# EAGLE design coin_acceptor (EAGLE 8.3.1)
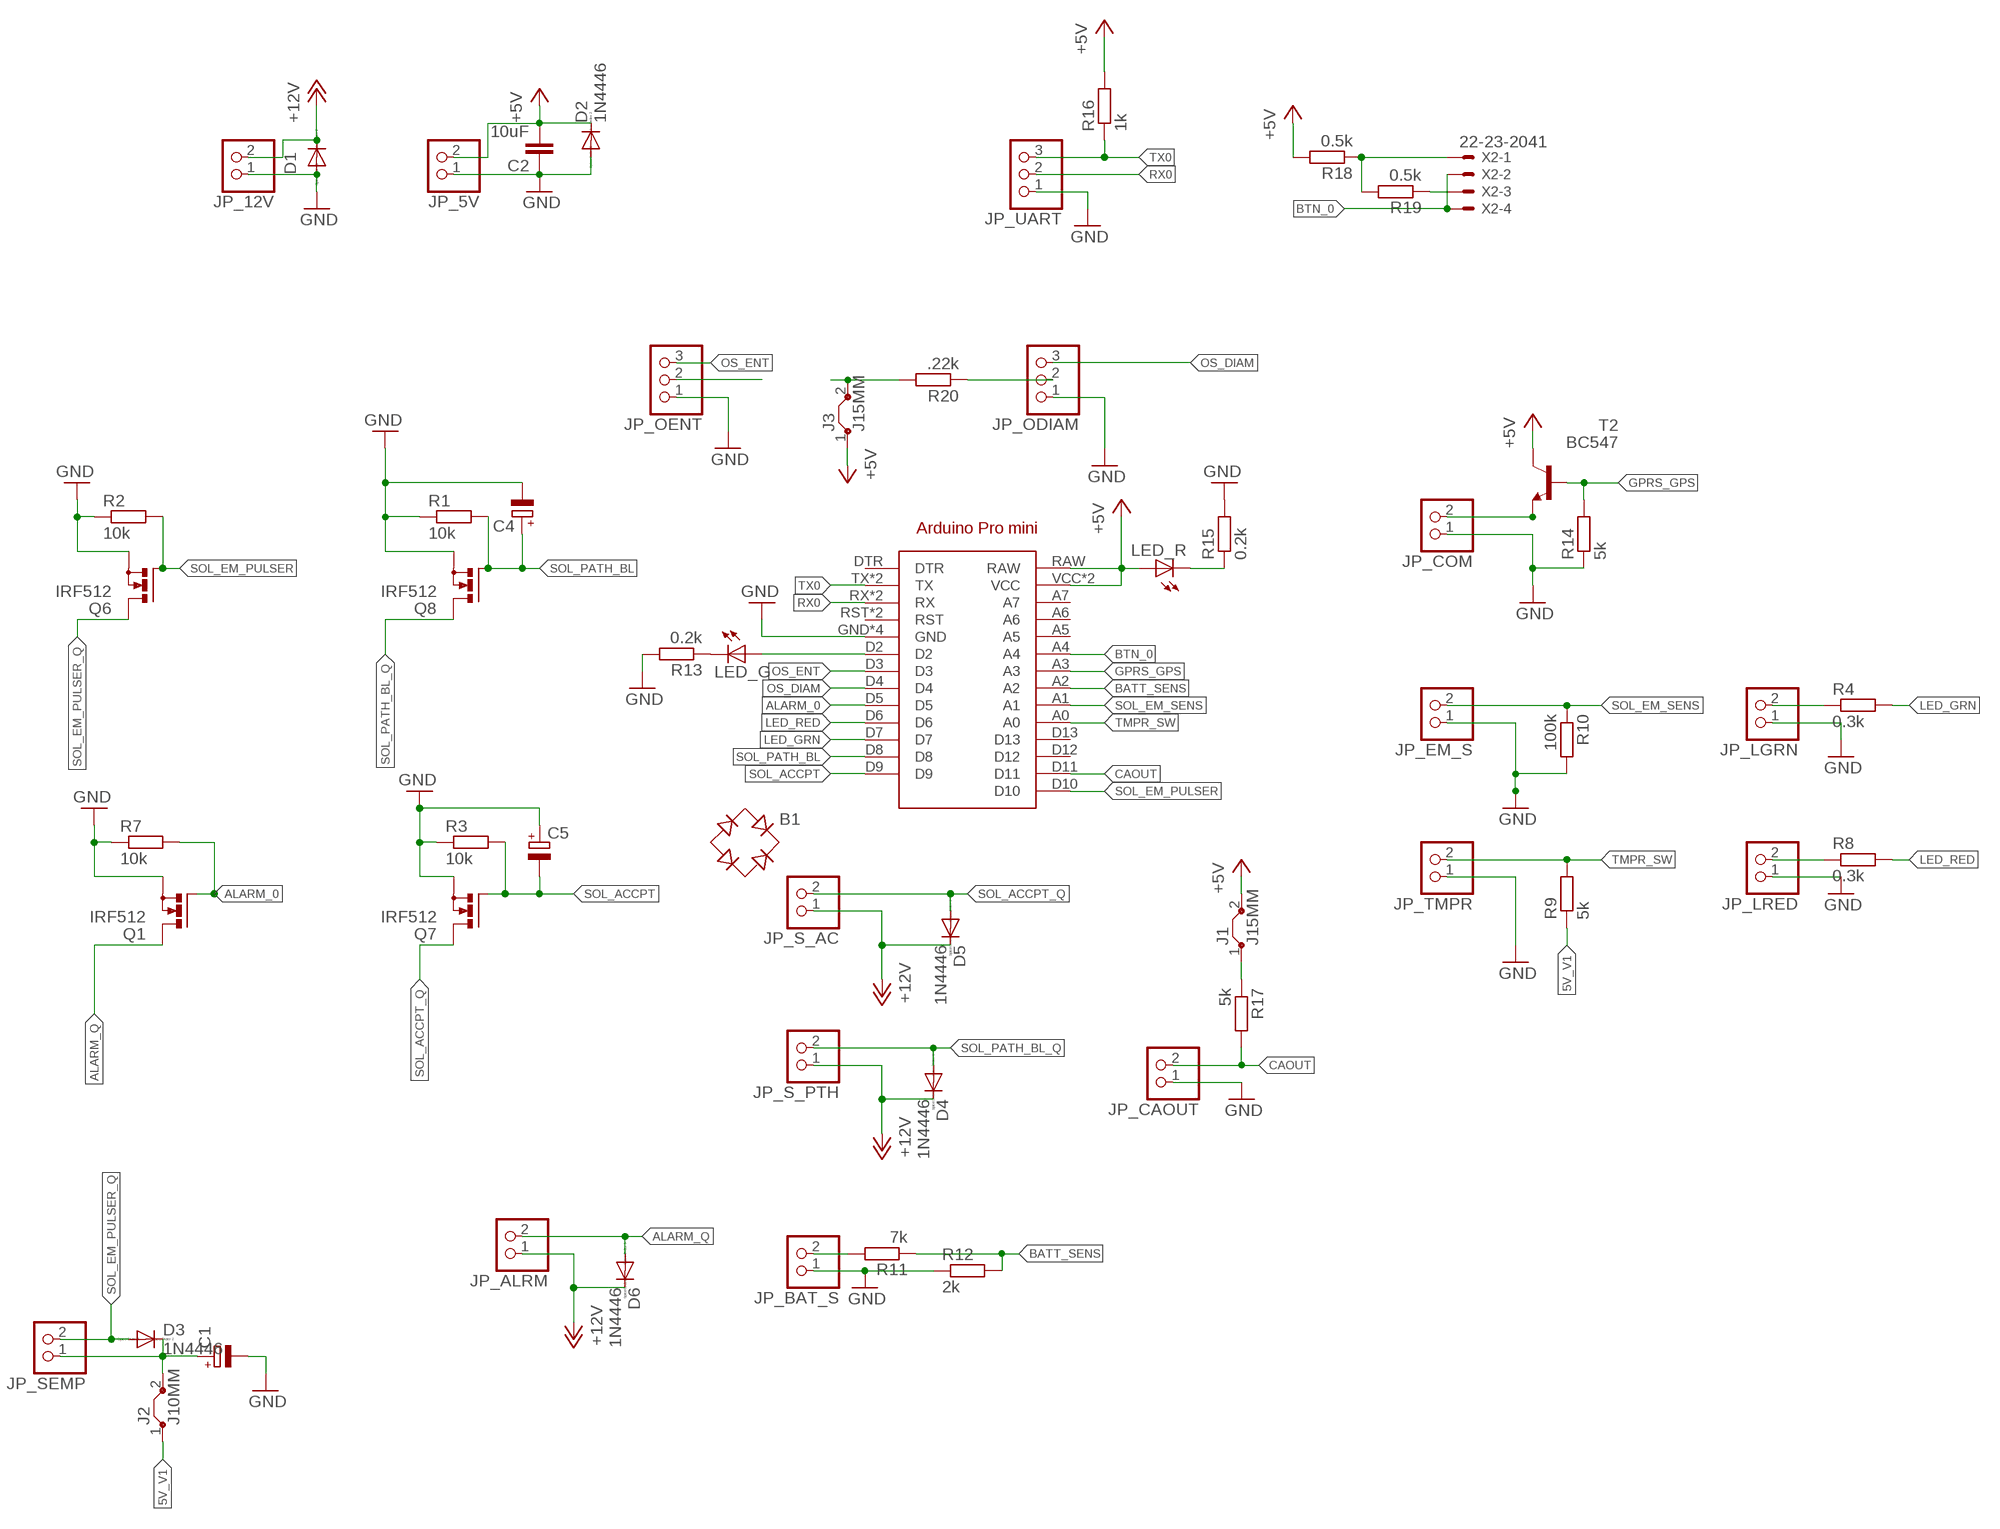
[diagram p0: schematic, sheet 1]

## Parts
ARDUINO1  ARDUINO_PRO_MINI  [ARDUINO_PRO_MINI]
B1  RB1A  [RB1A]
C1  CPOL-EUE2.5-5  [E2,5-5]
C2  10uF  C-EU025-024X044  [C025-024X044]
C4  CPOL-EUE2.5-5  [E2,5-5]
C5  CPOL-EUE2.5-5  [E2,5-5]
D1  1N4446  [DO35-10]
D2  1N4446  [DO35-10]
D3  1N4446  [DO35-10]
D4  1N4446  [DO35-10]
D5  1N4446  [DO35-10]
D6  1N4446  [DO35-10]
J1  J15MM  [15]
J2  J10MM  [10]
J3  J15MM  [15]
JP_5V  PINHD-1X2  [1X02]
JP_12V  PINHD-1X2  [1X02]
JP_ALRM  PINHD-1X2  [1X02]
JP_BAT_S  PINHD-1X2  [1X02]
JP_CAOUT  PINHD-1X2  [1X02]
JP_COM  PINHD-1X2  [1X02]
JP_EM_S  PINHD-1X2  [1X02]
JP_LGRN  PINHD-1X2  [1X02]
JP_LRED  PINHD-1X2  [1X02]
JP_ODIAM  PINHD-1X3  [1X03]
JP_OENT  PINHD-1X3  [1X03]
JP_S_AC  PINHD-1X2  [1X02]
JP_S_PTH  PINHD-1X2  [1X02]
JP_SEMP  PINHD-1X2  [1X02]
JP_TMPR  PINHD-1X2  [1X02]
JP_UART  PINHD-1X3  [1X03]
LED_G  LED5MM  [LED5MM]
LED_R  LED5MM  [LED5MM]
Q1  IRF512  [TO220BV]
Q6  IRF512  [TO220BV]
Q7  IRF512  [TO220BV]
Q8  IRF512  [TO220BV]
R1  10k  R-EU_0309/10  [0309/10]
R2  10k  R-EU_0309/10  [0309/10]
R3  10k  R-EU_0309/10  [0309/10]
R4  0.3k  R-EU_0309/10  [0309/10]
R7  10k  R-EU_0309/10  [0309/10]
R8  0.3k  R-EU_0309/10  [0309/10]
R9  5k  R-EU_0309/10  [0309/10]
R10  100k  R-EU_0309/10  [0309/10]
R11  7k  R-EU_0309/10  [0309/10]
R12  2k  R-EU_0309/10  [0309/10]
R13  0.2k  R-EU_0309/10  [0309/10]
R14  5k  R-EU_0309/10  [0309/10]
R15  0.2k  R-EU_0309/10  [0309/10]
R16  1k  R-EU_0309/10  [0309/10]
R17  5k  R-EU_0309/10  [0309/10]
R18  0.5k  R-EU_0309/10  [0309/10]
R19  0.5k  R-EU_0309/10  [0309/10]
R20  .22k  R-EU_0309/10  [0309/10]
T2  BC547  [TO92]
X2  22-23-2041  [22-23-2041]

## Nets
5V_V0 [Supply]: C1.+ D3.C J2.2 JP_SEMP.1
5V_V1 [Supply]: J1.1 J2.1 R9.1 R17.1
+5V [Supply]: ARDUINO1.RAW ARDUINO1.VCC ARDUINO1.VCC@1(VCC) C2.2 D2.C J1.2 J3.1 JP_5V.2 LED_R.A R16.2 R18.2 T2.3(C)
+12V: D1.C D4.C D5.C D6.C JP_12V.2 JP_ALRM.1 JP_S_AC.1 JP_S_PTH.1
ALARM_0: ARDUINO1.D5 Q1.G R7.2
ALARM_Q: D6.A JP_ALRM.2 Q1.D
BATT_SENS: ARDUINO1.A2 R11.1 R12.2
BTN_0: ARDUINO1.A4 X2.2 X2.4
CAOUT: ARDUINO1.D11 JP_CAOUT.2 R17.2
COM_Q: JP_COM.2 T2.1(E)
GND [Supply]: ARDUINO1.GND ARDUINO1.GND@1(GND) ARDUINO1.GND@2(GND) ARDUINO1.GND@3(GND) C1.- C2.1 C4.- C5.+ D1.A D2.A JP_5V.1 JP_12V.1 JP_BAT_S.1 JP_CAOUT.1 JP_COM.1 JP_EM_S.1 JP_LGRN.1 JP_LRED.1 JP_ODIAM.1 JP_OENT.1 JP_TMPR.1 JP_UART.1 Q1.S Q6.S Q7.S Q8.S R1.1 R2.1 R3.1 R7.1 R10.2 R12.1 R13.2 R14.1 R15.2
GPRS_GPS: ARDUINO1.A3 R14.2 T2.2(B)
LED_GRN: ARDUINO1.D7 R4.2
LED_RED: ARDUINO1.D6 R8.2
LGRN_Q: JP_LGRN.2 R4.1
LRED_Q: JP_LRED.2 R8.1
N$1: JP_BAT_S.2 R11.2
N$2: ARDUINO1.D2 LED_G.A
N$3: LED_G.K(C) R13.1
N$4: LED_R.K(C) R15.1
N$5 [Supply]: J3.2 R20.2
N$6: R18.1 R19.2 X2.1
N$7: R19.1 X2.3
N$8: JP_OENT.2
N$9: JP_ODIAM.2 R20.1
OS_DIAM: ARDUINO1.D4 JP_ODIAM.3
OS_ENT: ARDUINO1.D3 JP_OENT.3
RX0: ARDUINO1.RX ARDUINO1.RX@1(RX) JP_UART.2
SOL_ACCPT: ARDUINO1.D9 C5.- Q7.G R3.2
SOL_ACCPT_Q: D5.A JP_S_AC.2 Q7.D
SOL_EM_PULSER: ARDUINO1.D10 Q6.G R2.2
SOL_EM_PULSER_Q: D3.A JP_SEMP.2 Q6.D
SOL_EM_SENS [Analog]: ARDUINO1.A1 JP_EM_S.2 R10.1
SOL_PATH_BL: ARDUINO1.D8 C4.+ Q8.G R1.2
SOL_PATH_BL_Q: D4.A JP_S_PTH.2 Q8.D
TMPR_SW: ARDUINO1.A0 JP_TMPR.2 R9.2
TX0: ARDUINO1.TX ARDUINO1.TX@1(TX) JP_UART.3 R16.1
Unconnected: ARDUINO1.A5 ARDUINO1.A6 ARDUINO1.A7 ARDUINO1.D12 ARDUINO1.D13 ARDUINO1.DTR ARDUINO1.RST ARDUINO1.RST@1(RST) B1.+ B1.- B1.AC1 B1.AC2

## Library data of the parts
ARDUINO1 = arduinopromini:ARDUINO_PRO_MINI: For creating Arduino Pro Mini shields
B1 = rectifier:RB1A: RECTIFIER 1 A
C1 C4 C5 = rcl:CPOL-EU: POLARIZED CAPACITOR, European symbol
C2 = rcl:C-EU: CAPACITOR, European symbol
D1-D6 = diode:1N4446: DIODE high speed (Philips)
J1-J3 = jumper:J: Bridge
JP_5V JP_12V JP_ALRM JP_BAT_S JP_CAOUT JP_COM JP_EM_S JP_LGRN JP_LRED JP_S_AC JP_S_PTH JP_SEMP JP_TMPR = pinhead:PINHD-1X2: PIN HEADER
JP_ODIAM JP_OENT JP_UART = pinhead:PINHD-1X3: PIN HEADER
LED_G LED_R = led:LED: LED OSRAM: - CHIPLED LG R971, LG N971, LY N971, LG Q971, LY Q971, LO R971, LY R971 LH N974, LH R974 LS Q976, LO Q976, LY Q976 LO Q996 - Hyper CHIPLED LW Q18S LB Q993, LB Q99A, LB R99A - SideLED LS A670, LO A670, LY A670, LG A670, LP A670 LB A673, LV A673, LT A673, LW A673 LH A674 LY A675 LS A676, LA A676, LO A676, LY A676, LW A676 LS A679, LY A679, LG A679 - Hyper Micro SIDELED® LS Y876, LA Y876, LO Y876, LY Y876 LT Y87S - SmartLED LW L88C, LW L88S LB L89C, LB L89S, LG L890 LS L89K, LO L89K, LY L89K LS L896, LA L896, LO L896, LY L896 - TOPLED LS T670, LO T670, LY T670, LG T670, LP T670 LSG T670, LSP T670, LSY T670, LOP T670, LYG T670 LG T671, LOG T671, LSG T671 LB T673, LV T673, LT T673, LW T673 LH T674 LS T676, LA T676, LO T676, LY T676, LB T676, LH T676, LSB T676, LW T676 LB T67C, LV T67C, LT T67C, LS T67K, LO T67K, LY T67K, LW E67C LS E67B, LA E67B, LO E67B, LY E67B, LB E67C, LV E67C, LT E67C LW T67C LS T679, LY T679, LG T679 LS T770, LO T770, LY T770, LG T770, LP T770 LB T773, LV T773, LT T773, LW T773 LH T774 LS E675, LA E675, LY E675, LS T675 LS T776, LA T776, LO T776, LY T776, LB T776 LHGB T686 LT T68C, LB T68C - Hyper Mini TOPLED® LB M676 - Mini TOPLED Santana® LG M470 LS M47K, LO M47K, LY M47K Source: http://www.osram.convergy.de LUXEON: - LUMILED® LXK2-PW12-R00, LXK2-PW12-S00, LXK2-PW14-U00, LXK2-PW14-V00 LXK2-PM12-R00, LXK2-PM12-S00, LXK2-PM14-U00 LXK2-PE12-Q00, LXK2-PE12-R00, LXK2-PE12-S00, LXK2-PE14-T00, LXK2-PE14-U00 LXK2-PB12-K00, LXK2-PB12-L00, LXK2-PB12-M00, LXK2-PB14-N00, LXK2-PB14-P00, LXK2-PB14-Q00 LXK2-PR12-L00, LXK2-PR12-M00, LXK2-PR14-Q00, LXK2-PR14-R00 LXK2-PD12-Q00, LXK2-PD12-R00, LXK2-PD12-S00 LXK2-PH12-R00, LXK2-PH12-S00 LXK2-PL12-P00, LXK2-PL12-Q00, LXK2-PL12-R00 Source: www.luxeon.com KINGBRIGHT: KA-3528ASYC Source: www.kingbright.com
Q1 Q6-Q8 = transistor-power:IRF512: N-CHANNEL MOS FET
R1-R4 R7-R20 = resistor:R-EU_: RESISTOR, European symbol
T2 = transistor:BC547: NPN TRANSISTOR
X2 = con-molex:22-23-2041: .100" (2.54mm) Center Header - 4 Pin; MF: MOLEX; MPN: 22-23-2041; OC_FARNELL: 1462920; OC_NEWARK: 38C0355

## Net classes
0 default: width 0.508 mm, drill 0.305 mm
1 Supply: width 0.61 mm, drill 0.305 mm
2 Analog: width 0.61 mm, drill 0.305 mm, clearance 0.254 mm

## Board
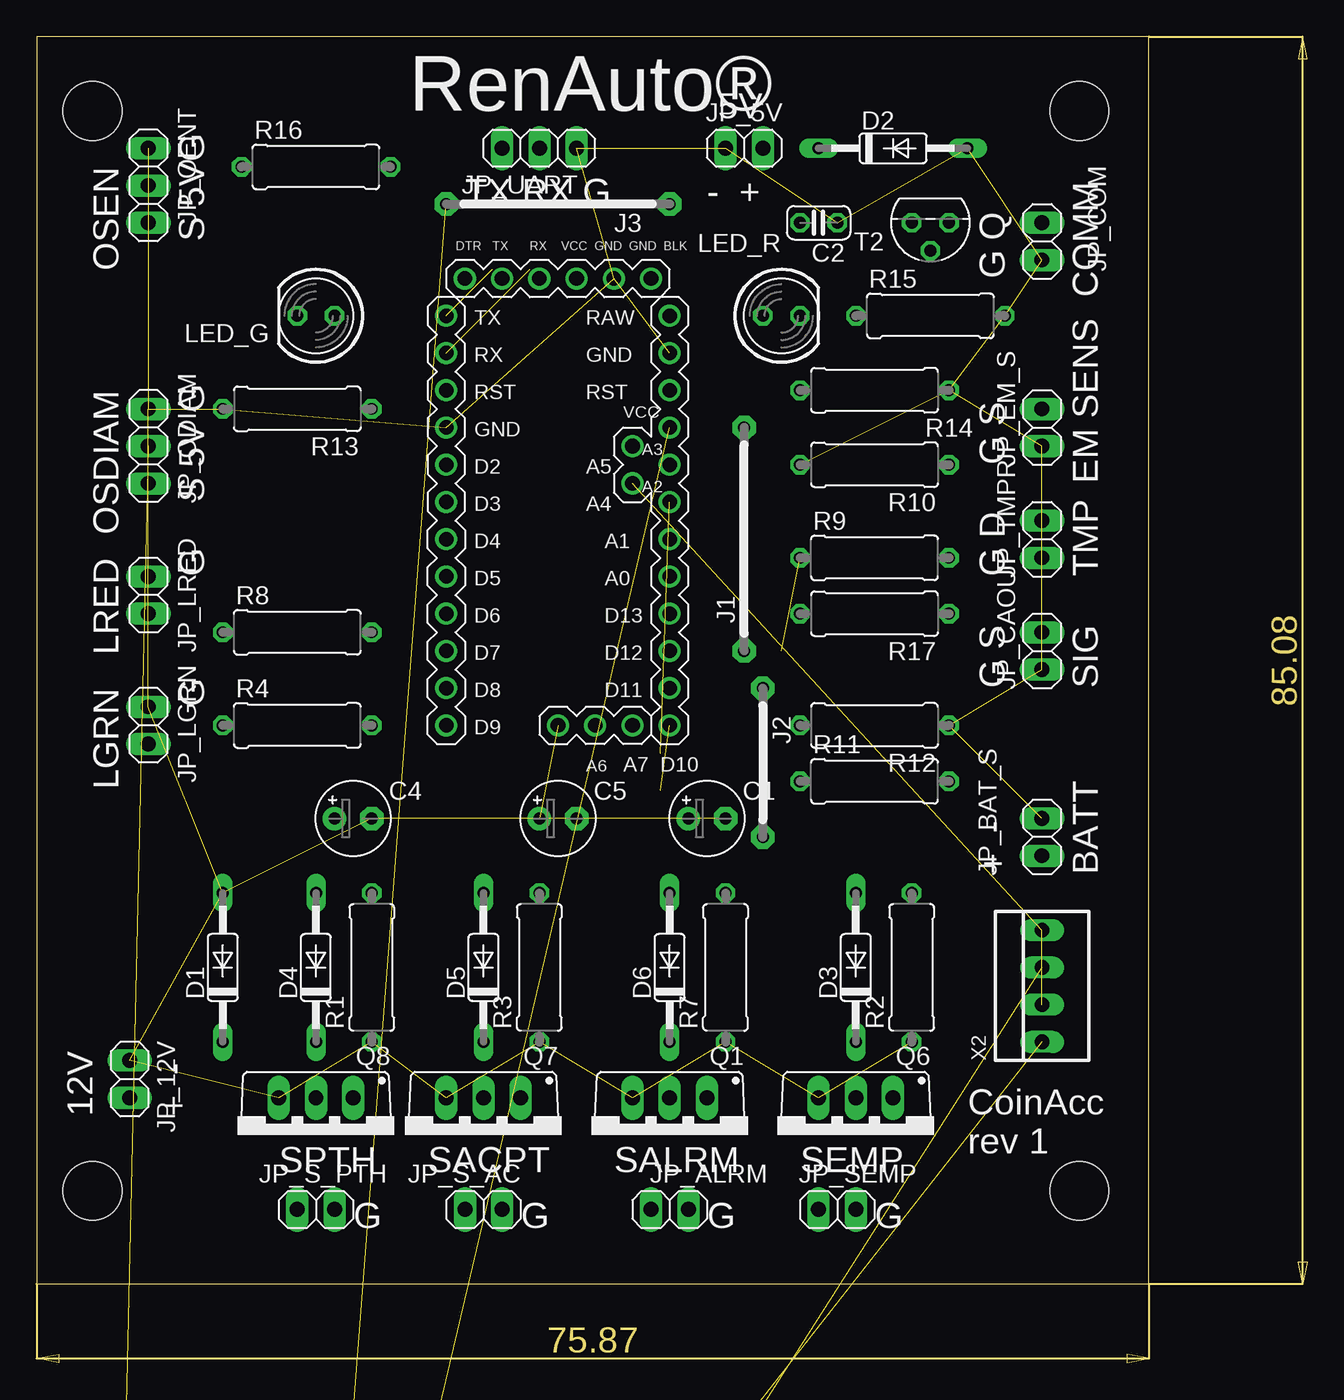
[diagram p1: board, top side]
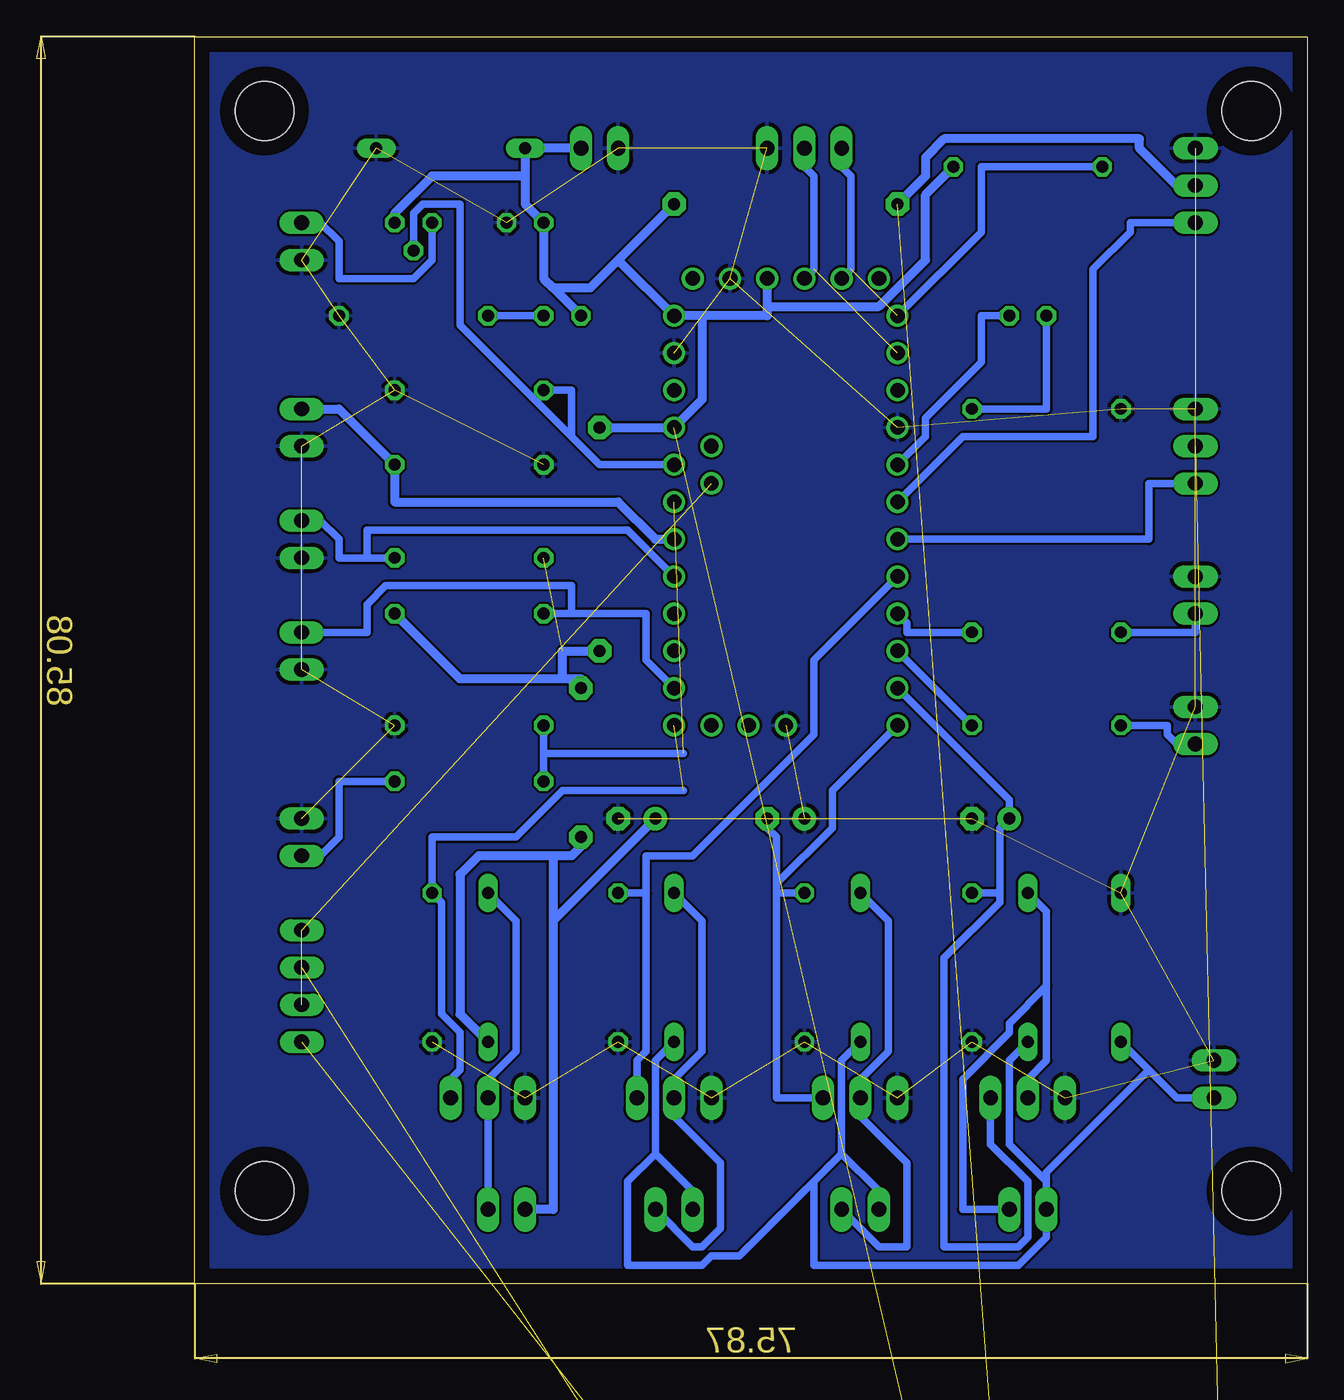
[diagram p2: board, bottom side, seen from below]

Size 75.87 x 85.08 mm. Coordinates in mm from the lower left corner, seen from the top.
Outline: 0,0 75.87,0 75.87,85.08 0,85.08 0,0
Copper layers (1*16): Top 0.035mm / dielectric 1.5mm / Bottom 0.035mm
Design rules "default *": minimum track width 20mil, minimum drill 0.35mm, track to track 6mil, track to pad 6mil, pad to pad 6mil, via to via 6mil, smd to smd 6mil, copper to edge 40mil, drill to drill 6mil, minimum pad ring 10mil, minimum via ring 8mil, stop-mask expansion 4mil, vias tented up to drill 0mil, thermal gap 10mil
Holes 4 mm at 71.12,80.01 3.81,80.01 71.12,6.35 3.81,6.35

### Footprints (pad centres in the part's own frame; a part is rotated, then mirrored left to right if it is on the bottom)
ARDUINO_PRO_MINI = drill 1: A0 11.43,-8.89; A1 11.43,-6.35; A2 11.43,-3.81; A3 11.43,-1.27; A4 8.89,-2.54; A5 8.89,0; A6 6.35,-19.05; A7 8.89,-19.05; BLK 10.16,11.43; D2 -3.81,-1.27; D3 -3.81,-3.81; D4 -3.81,-6.35; D5 -3.81,-8.89; D6 -3.81,-11.43; D7 -3.81,-13.97; D8 -3.81,-16.51; D9 -3.81,-19.05; D10 11.43,-19.05; D11 11.43,-16.51; D12 11.43,-13.97; D13 11.43,-11.43; DTR -2.54,11.43; GND -3.81,1.27; GND@1 11.43,6.35; GND@2 7.62,11.43; GND@3 3.81,-19.05; RAW 11.43,8.89; RST 11.43,3.81; RST@1 -3.81,3.81; RX -3.81,6.35; RX@1 2.54,11.43; TX -3.81,8.89; TX@1 0,11.43; VCC 11.43,1.27; VCC@1 5.08,11.43
RB1A = drill 1.016: + -2.54,2.54 | drill 1.016 octagon: - 2.54,-2.54; AC1 2.54,2.54; AC2 -2.54,-2.54
E2,5-5 = drill 0.813 pad 1.6: + -1.27,0 | drill 0.813 pad 1.6 octagon: - 1.27,0
C025-024X044 = drill 0.813 octagon: 1 -1.27,0; 2 1.27,0
DO35-10 = drill 0.813 long: A 5.08,0; C -5.08,0
15 = drill 0.813 pad 1.6 octagon: 1 -7.62,0; 2 7.62,0
10 = drill 0.813 pad 1.6 octagon: 1 -5.08,0; 2 5.08,0
1X02 = drill 1.016 long: 1 -1.27,0; 2 1.27,0
1X03 = drill 1.016 long: 1 -2.54,0; 2 0,0; 3 2.54,0
LED5MM = drill 0.813 octagon: A -1.27,0; K 1.27,0
TO220BV = drill 1.016 long: D 0,-2.54; G -2.54,-2.54; S 2.54,-2.54
0309/10 = drill 0.813 octagon: 1 -5.08,0; 2 5.08,0
TO92 = drill 0.813 octagon: 1 1.27,0; 2 0,1.905; 3 -1.27,0
22-23-2041 = drill 1 long: 1 -3.81,0; 2 -1.27,0; 3 1.27,0; 4 3.81,0

### Placement (x,y rotation side)
ARDUINO1  31.75,57.15 0 top
B1  6.35,-17.78 0 top  (outside the outline)
C1  45.72,31.75 0 top
C2  53.34,72.39 180 top
C4  21.59,31.75 0 top
C5  35.56,31.75 0 top
D1  12.7,21.59 90 top
D2  58.42,77.47 0 top
D3  55.88,21.59 90 top
D4  19.05,21.59 90 top
D5  30.48,21.59 90 top
D6  43.18,21.59 90 top
J1  48.26,50.8 90 top
J2  49.53,35.56 270 top
J3  35.56,73.66 180 top
JP_5V  48.26,77.47 0 top
JP_12V  6.35,13.97 270 top
JP_ALRM  43.18,5.08 0 top
JP_BAT_S  68.58,30.48 270 top
JP_CAOUT  68.58,43.18 90 top
JP_COM  68.58,71.12 90 top
JP_EM_S  68.58,58.42 90 top
JP_LGRN  7.62,38.1 270 top
JP_LRED  7.62,46.99 270 top
JP_ODIAM  7.62,57.15 270 top
JP_OENT  7.62,74.93 270 top
JP_S_AC  30.48,5.08 0 top
JP_S_PTH  19.05,5.08 0 top
JP_SEMP  54.61,5.08 0 top
JP_TMPR  68.58,50.8 90 top
JP_UART  34.29,77.47 180 top
LED_G  19.05,66.04 180 top
LED_R  50.8,66.04 0 top
Q1  43.18,10.16 180 top
Q6  55.88,10.16 180 top
Q7  30.48,10.16 180 top
Q8  19.05,10.16 180 top
R1  22.86,21.59 90 top
R2  59.69,21.59 90 top
R3  34.29,21.59 90 top
R4  17.78,38.1 0 top
R7  46.99,21.59 90 top
R8  17.78,44.45 0 top
R9  57.15,49.53 0 top
R10  57.15,55.88 180 top
R11  57.15,34.29 0 top
R12  57.15,38.1 180 top
R13  17.78,59.69 180 top
R14  57.15,60.96 180 top
R15  60.96,66.04 0 top
R16  19.05,76.2 0 top
R17  57.15,45.72 180 top
R18  8.89,-66.04 0 top  (outside the outline)
R19  8.89,-80.01 0 top  (outside the outline)
R20  8.89,-107.95 0 top  (outside the outline)
T2  60.96,72.39 180 top
X2  68.58,20.32 90 top

### Tracks (layer width: path | path; a pad name or v marks a point on that pad's centre or on a via)
5V_V0
  Bottom 0.61: D3.C 57.79,18.41 57.79,27.94 56.51,29.21 51.43,29.21 | 51.43,29.21 50.16,29.21 49.53,29.84 J2.2 | JP_SEMP.1 51.43,5.08 51.43,24.77 | 51.43,29.21 51.43,24.77 | 51.43,24.77 C1.+
5V_V1  (1 unrouted)
  Bottom 0.61: R17.1 57.79,41.27 50.8,41.27 | 50.8,41.27 49.53,41.27 J2.1 | J1.1 50.8,43.18 50.8,41.27
+5V  (1 unrouted)
  Bottom 0.61: 51.43,67.95 52.07,68.58 C2.2 53.34,73.66 53.34,75.57 | 51.43,67.95 LED_R.A | 46.99,69.85 48.9,67.95 51.43,67.95 | 46.99,69.85 J3.1 | JP_5V.2 D2.C 53.34,75.57 | T2.3 62.23,73.03 59.69,75.57 53.34,75.57 | J1.2 ARDUINO1.VCC 41.27,60.32 41.27,66.04 | R16.2 26.03,74.3 26.03,69.85 29.21,66.68 36.83,66.68 | ARDUINO1.VCC@1 36.83,66.68 | 41.27,66.04 36.83,66.04 36.83,66.68 | 41.27,66.04 ARDUINO1.RAW 46.99,69.85
+12V
  Bottom 0.508: 10.79,14.61 8.89,12.7 JP_12V.2 | 10.79,14.61 D1.C | D4.C 20.32,15.24 20.32,9.53 17.78,6.99 | 17.78,6.99 JP_S_PTH.1 17.78,3.17 19.69,1.27 33.66,1.27 33.66,6.99 | 10.79,14.61 17.78,7.62 17.78,6.99 | D5.C 31.75,15.24 31.75,8.89 | 31.75,8.89 29.21,6.35 JP_S_AC.1 | D6.C 44.45,15.24 44.45,8.89 | 44.45,8.89 41.91,6.35 JP_ALRM.1 | 33.66,6.99 38.73,1.91 40.64,1.91 41.27,1.27 46.35,1.27 46.35,6.99 44.45,8.89 | 33.66,6.99 31.75,8.89
ALARM_0
  Bottom 0.508: 45.09,26.67 R7.2 | 45.09,26.67 45.09,15.88 45.72,15.24 Q1.G | ARDUINO1.D5 33.66,42.55 33.66,37.46 41.91,29.21 45.09,29.21 45.09,26.67
ALARM_Q
  Bottom 0.508: D6.A 41.27,24.77 41.27,15.88 43.18,13.97 Q1.D 43.18,11.43 40.01,8.25 40.01,3.81 41.27,2.54 41.91,2.54 JP_ALRM.2
BATT_SENS  (1 unrouted)
  Bottom 0.508: R12.2 52.07,36.2 | 52.07,36.2 R11.1 | 52.07,36.2 42.55,36.2
BTN_0  (2 unrouted)
CAOUT
  Bottom 0.508: 50.16,45.72 45.09,45.72 45.09,42.55 ARDUINO1.D11 | 50.16,45.72 R17.2 | JP_CAOUT.2 64.13,44.45 64.13,46.35 62.87,47.62 50.16,47.62 50.16,45.72
COM_Q
  Bottom 0.508: T2.1 59.69,69.85 60.96,68.58 66.04,68.58 66.04,71.12 67.31,72.39 JP_COM.2
GND  (34 unrouted)
  pour Bottom: -3.81,88.9 -3.81,-2.54 81.28,-2.54 81.28,90.17 -3.81,90.17
GPRS_GPS
  Bottom 0.508: R14.2 50.16,60.96 50.16,57.78 | 50.16,57.78 48.26,55.88 ARDUINO1.A3 | T2.2 60.96,73.03 60.32,73.66 57.79,73.66 57.79,65.41 50.16,57.78
LED_GRN
  Bottom 0.508: ARDUINO1.D7 R4.2
LED_RED
  Bottom 0.508: R8.2 27.3,44.45 27.3,45.09 ARDUINO1.D6
LGRN_Q
  Bottom 0.508: R4.1 9.52,38.1 9.52,37.46 8.89,36.83 JP_LGRN.2
LRED_Q
  Bottom 0.508: R8.1 7.62,44.45 JP_LRED.2
N$1
  Bottom 0.508: R11.2 66.04,34.29 66.04,30.48 67.31,29.21 JP_BAT_S.2
N$2
  Bottom 0.508: LED_G.A 22.23,66.04 22.23,62.87 26.03,59.05 26.03,57.78 ARDUINO1.D2
N$3
  Bottom 0.508: R13.1 17.78,59.69 LED_G.K
N$4
  Bottom 0.508: R15.1 LED_R.K
N$5  (1 unrouted)
  Bottom 0.61: J3.2 26.03,75.57 26.03,76.84 24.77,78.11 11.43,78.11 11.43,77.47 8.89,74.93
N$6  (2 unrouted)
N$7  (1 unrouted)
N$9  (1 unrouted)
OS_DIAM
  Bottom 0.508: JP_ODIAM.3 10.79,54.61 10.79,50.8 ARDUINO1.D4
OS_ENT
  Bottom 0.508: JP_OENT.3 12.06,72.39 12.06,71.76 14.6,69.22 14.6,57.78 23.49,57.78 ARDUINO1.D3
RX0  (1 unrouted)
  Bottom 0.508: 34.29,78.74 JP_UART.2 34.29,76.2 33.66,75.57 33.66,69.22 ARDUINO1.RX@1
SOL_ACCPT
  Bottom 0.508: 36.2,26.67 R3.2 | 36.2,27.3 36.2,30.48 36.83,31.11 C5.- | 36.2,27.3 36.2,26.67 | ARDUINO1.D9 32.38,33.66 32.38,31.11 36.2,27.3 | Q7.G 36.2,12.7 36.2,26.67
SOL_ACCPT_Q
  Bottom 0.508: D5.A 28.58,24.77 28.58,15.88 30.48,13.97 Q7.D 30.48,11.43 27.3,8.25 27.3,2.54 29.21,2.54 JP_S_AC.2
SOL_EM_PULSER  (1 unrouted)
  Bottom 0.508: Q6.G 58.42,13.97 57.79,14.61 57.79,17.14 59.05,18.41 59.05,26.04 R2.2 59.69,30.48 53.98,30.48 50.8,33.66 42.55,33.66
SOL_EM_PULSER_Q
  Bottom 0.508: D3.A 53.98,24.77 53.98,15.88 55.88,13.97 Q6.D JP_SEMP.2
SOL_EM_SENS
  Bottom 0.61: JP_EM_S.2 66.04,59.69 R10.1 62.23,53.34 46.99,53.34 44.45,50.8 ARDUINO1.A1
SOL_PATH_BL
  Bottom 0.508: 20.95,26.67 R1.2 | 20.95,26.67 20.95,31.11 C4.+ 20.32,33.02 ARDUINO1.D8 | Q8.G 21.59,9.53 19.05,6.99 19.05,3.17 19.69,2.54 24.77,2.54 24.77,22.22 20.95,26.04 20.95,26.67
SOL_PATH_BL_Q
  Bottom 0.508: D4.A 17.78,25.4 17.78,20.32 | 17.78,20.32 17.78,15.24 19.05,13.97 Q8.D | JP_S_PTH.2 23.49,5.08 23.49,13.97 20.32,17.14 20.32,17.78 17.78,20.32
TMPR_SW
  Bottom 0.508: 64.13,49.53 66.04,49.53 66.04,50.8 67.31,52.07 JP_TMPR.2 | 64.13,49.53 R9.2 | ARDUINO1.A0 46.35,51.44 64.13,51.44 64.13,49.53
TX0  (1 unrouted)
  Bottom 0.508: ARDUINO1.TX@1 31.12,69.22 31.12,75.57 31.75,76.2 JP_UART.3 | R16.1 22.23,76.2 22.23,71.76 ARDUINO1.TX

### Text on the board
tPlace: 5V | RenAuto® | OSEN | TX RX G | - + | S 5VG | G Q | COMM | OSDIAM | G S | EM SENS | S 5V G | LRED | G | G D | TMP | LGRN | G S | SIG | G | + - | + - | BATT | 12V | + - | CoinAcc / rev 1 | SPTH | SACPT | SALRM | SEMP | G | G | G | G